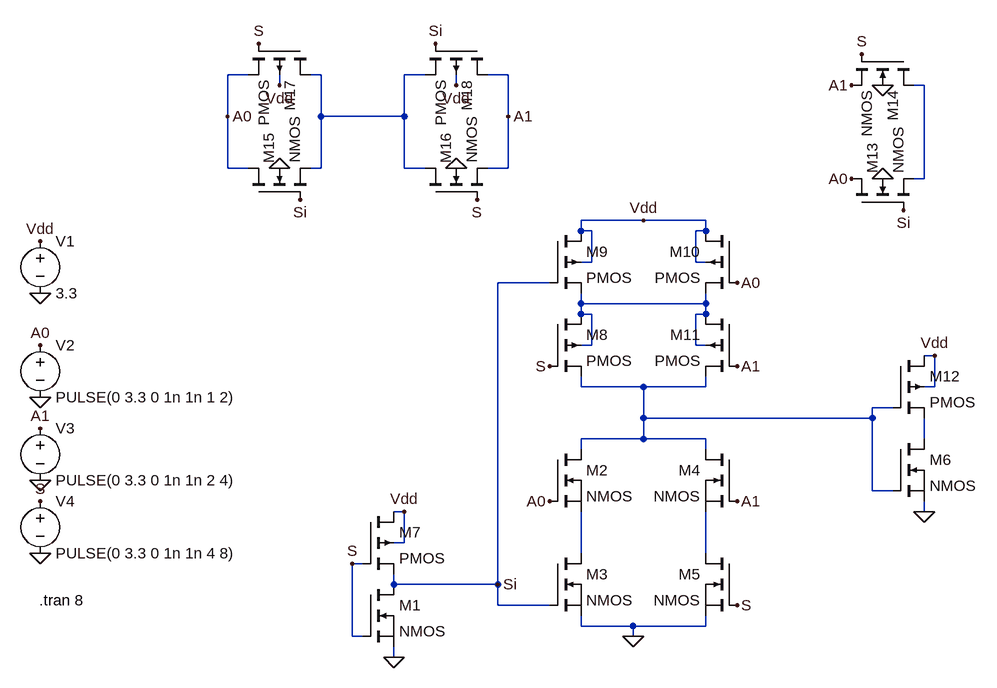
[diagram p0: schematic cmos_mux2x1.asc]
cmos_mux2x1.asc, the LTspice schematic file:
Version 4
SHEET 1 2848 680
WIRE -192 -544 -224 -544
WIRE -80 -544 -96 -544
WIRE 80 -544 48 -544
WIRE 208 -544 176 -544
WIRE -144 -528 -144 -544
WIRE 128 -528 128 -544
WIRE 848 -528 832 -528
WIRE -224 -480 -224 -544
WIRE -80 -480 -80 -544
WIRE 48 -480 48 -544
WIRE 48 -480 -80 -480
WIRE 208 -480 208 -544
WIRE -224 -400 -224 -480
WIRE -192 -400 -224 -400
WIRE -80 -400 -80 -480
WIRE -80 -400 -96 -400
WIRE 48 -400 48 -480
WIRE 80 -400 48 -400
WIRE 208 -400 208 -480
WIRE 208 -400 176 -400
WIRE 848 -384 848 -528
WIRE 848 -384 832 -384
WIRE 416 -320 320 -320
WIRE 512 -320 416 -320
WIRE 320 -304 320 -320
WIRE 336 -304 320 -304
WIRE 512 -304 512 -320
WIRE 512 -304 496 -304
WIRE 336 -256 336 -304
WIRE 336 -256 320 -256
WIRE 496 -256 496 -304
WIRE 512 -256 496 -256
WIRE 272 -224 192 -224
WIRE 320 -192 320 -208
WIRE 512 -192 512 -208
WIRE 512 -192 320 -192
WIRE 320 -176 320 -192
WIRE 336 -176 320 -176
WIRE 512 -176 512 -192
WIRE 512 -176 496 -176
WIRE 336 -128 336 -176
WIRE 336 -128 320 -128
WIRE 496 -128 496 -176
WIRE 512 -128 496 -128
WIRE 864 -112 848 -112
WIRE 320 -64 320 -80
WIRE 416 -64 320 -64
WIRE 512 -64 512 -80
WIRE 512 -64 416 -64
WIRE 864 -64 864 -112
WIRE 864 -64 848 -64
WIRE 800 -32 768 -32
WIRE 416 -16 416 -64
WIRE 768 -16 768 -32
WIRE 768 -16 416 -16
WIRE 416 16 416 -16
WIRE 416 16 320 16
WIRE 512 16 416 16
WIRE 848 16 848 -16
WIRE 320 32 320 16
WIRE 512 32 512 16
WIRE 768 96 768 -16
WIRE 800 96 768 96
WIRE 48 128 32 128
WIRE 848 128 848 112
WIRE 48 176 48 128
WIRE 48 176 32 176
WIRE 320 192 320 128
WIRE 512 192 512 128
WIRE -16 208 -32 208
WIRE 32 240 32 224
WIRE 192 240 192 -224
WIRE 192 240 32 240
WIRE 192 272 192 240
WIRE 272 272 192 272
WIRE 320 304 320 288
WIRE 400 304 320 304
WIRE 512 304 512 288
WIRE 512 304 400 304
WIRE -32 320 -32 208
WIRE -16 320 -32 320
WIRE 400 320 400 304
WIRE 32 352 32 336
FLAG 400 320 0
FLAG 32 352 0
FLAG 848 128 0
FLAG -32 208 S
FLAG 560 272 S
FLAG 272 -96 S
FLAG 272 112 A0
FLAG 560 -224 A0
FLAG 560 -96 A1
FLAG 560 112 A1
FLAG 48 128 Vdd
FLAG 416 -320 Vdd
FLAG 864 -112 Vdd
FLAG -512 -208 0
FLAG -512 -288 Vdd
FLAG -512 -48 0
FLAG -512 80 0
FLAG -512 192 0
FLAG -512 -128 A0
FLAG -512 0 A1
FLAG -512 112 S
FLAG 192 240 Si
FLAG 816 -336 Si
FLAG 736 -384 A0
FLAG 736 -528 A1
FLAG 752 -576 S
FLAG -112 -352 Si
FLAG 96 -592 Si
FLAG -176 -592 S
FLAG 160 -352 S
FLAG -144 -400 0
FLAG 128 -400 0
FLAG -144 -528 Vdd
FLAG 128 -528 Vdd
FLAG -224 -480 A0
FLAG 208 -480 A1
FLAG 784 -528 0
FLAG 784 -384 0
SYMBOL nmos -16 240 R0
SYMATTR InstName M1
SYMBOL nmos 272 32 R0
SYMATTR InstName M2
SYMBOL nmos 272 192 R0
SYMATTR InstName M3
SYMBOL nmos 560 32 M0
SYMATTR InstName M4
SYMBOL nmos 560 192 M0
SYMATTR InstName M5
SYMBOL nmos 800 16 R0
SYMATTR InstName M6
SYMBOL pmos4 -16 128 R0
SYMATTR InstName M7
SYMBOL pmos4 272 -176 R0
SYMATTR InstName M8
SYMBOL pmos4 272 -304 R0
SYMATTR InstName M9
SYMBOL pmos4 560 -304 M0
SYMATTR InstName M10
SYMBOL pmos4 560 -176 M0
SYMATTR InstName M11
SYMBOL pmos4 800 -112 R0
SYMATTR InstName M12
SYMBOL voltage -512 -304 R0
SYMATTR InstName V1
SYMATTR Value 3.3
SYMBOL voltage -512 -144 R0
WINDOW 123 0 0 Left 0
WINDOW 39 0 0 Left 0
SYMATTR InstName V2
SYMATTR Value PULSE(0 3.3 0 1n 1n 1 2)
SYMBOL voltage -512 -16 R0
SYMATTR InstName V3
SYMATTR Value PULSE(0 3.3 0 1n 1n 2 4)
SYMBOL voltage -512 96 R0
SYMATTR InstName V4
SYMATTR Value PULSE(0 3.3 0 1n 1n 4 8)
SYMBOL pmos4 -96 -592 R90
SYMATTR InstName M17
SYMBOL pmos4 176 -592 R90
SYMATTR InstName M18
SYMBOL nmos4 -192 -352 R270
SYMATTR InstName M15
SYMBOL nmos4 80 -352 R270
SYMATTR InstName M16
SYMBOL nmos4 832 -576 R90
SYMATTR InstName M14
SYMBOL nmos4 736 -336 R270
SYMATTR InstName M13
TEXT -514 264 Left 2 !.tran 8

The netlist it stands for:
* cmos_mux2x1.asc
M1 Si S 0 0 NMOS
M2 N004 A0 N006 N006 NMOS
M3 N006 Si 0 0 NMOS
M4 N004 A1 N007 N007 NMOS
M5 N007 S 0 0 NMOS
M6 N005 N004 0 0 NMOS
M7 Vdd S Si Vdd PMOS
M8 N003 S N004 N003 PMOS
M9 Vdd Si N003 Vdd PMOS
M10 Vdd A0 N003 Vdd PMOS
M11 N003 A1 N004 N003 PMOS
M12 Vdd N004 N005 Vdd PMOS
V1 Vdd 0 3.3
V2 A0 0 PULSE(0 3.3 0 1n 1n 1 2)
V3 A1 0 PULSE(0 3.3 0 1n 1n 2 4)
V4 S 0 PULSE(0 3.3 0 1n 1n 4 8)
M17 N001 S A0 Vdd PMOS
M18 A1 Si N001 Vdd PMOS
M15 A0 Si N001 0 NMOS
M16 N001 S A1 0 NMOS
M14 N002 S A1 0 NMOS
M13 A0 Si N002 0 NMOS
.model NMOS NMOS
.model PMOS PMOS
.lib standard.mos
.tran 8
.backanno
.end